# Altium schematic sheet Sheet1.SchDoc
size A3; SheetNumber: 1; SheetTotal: 1
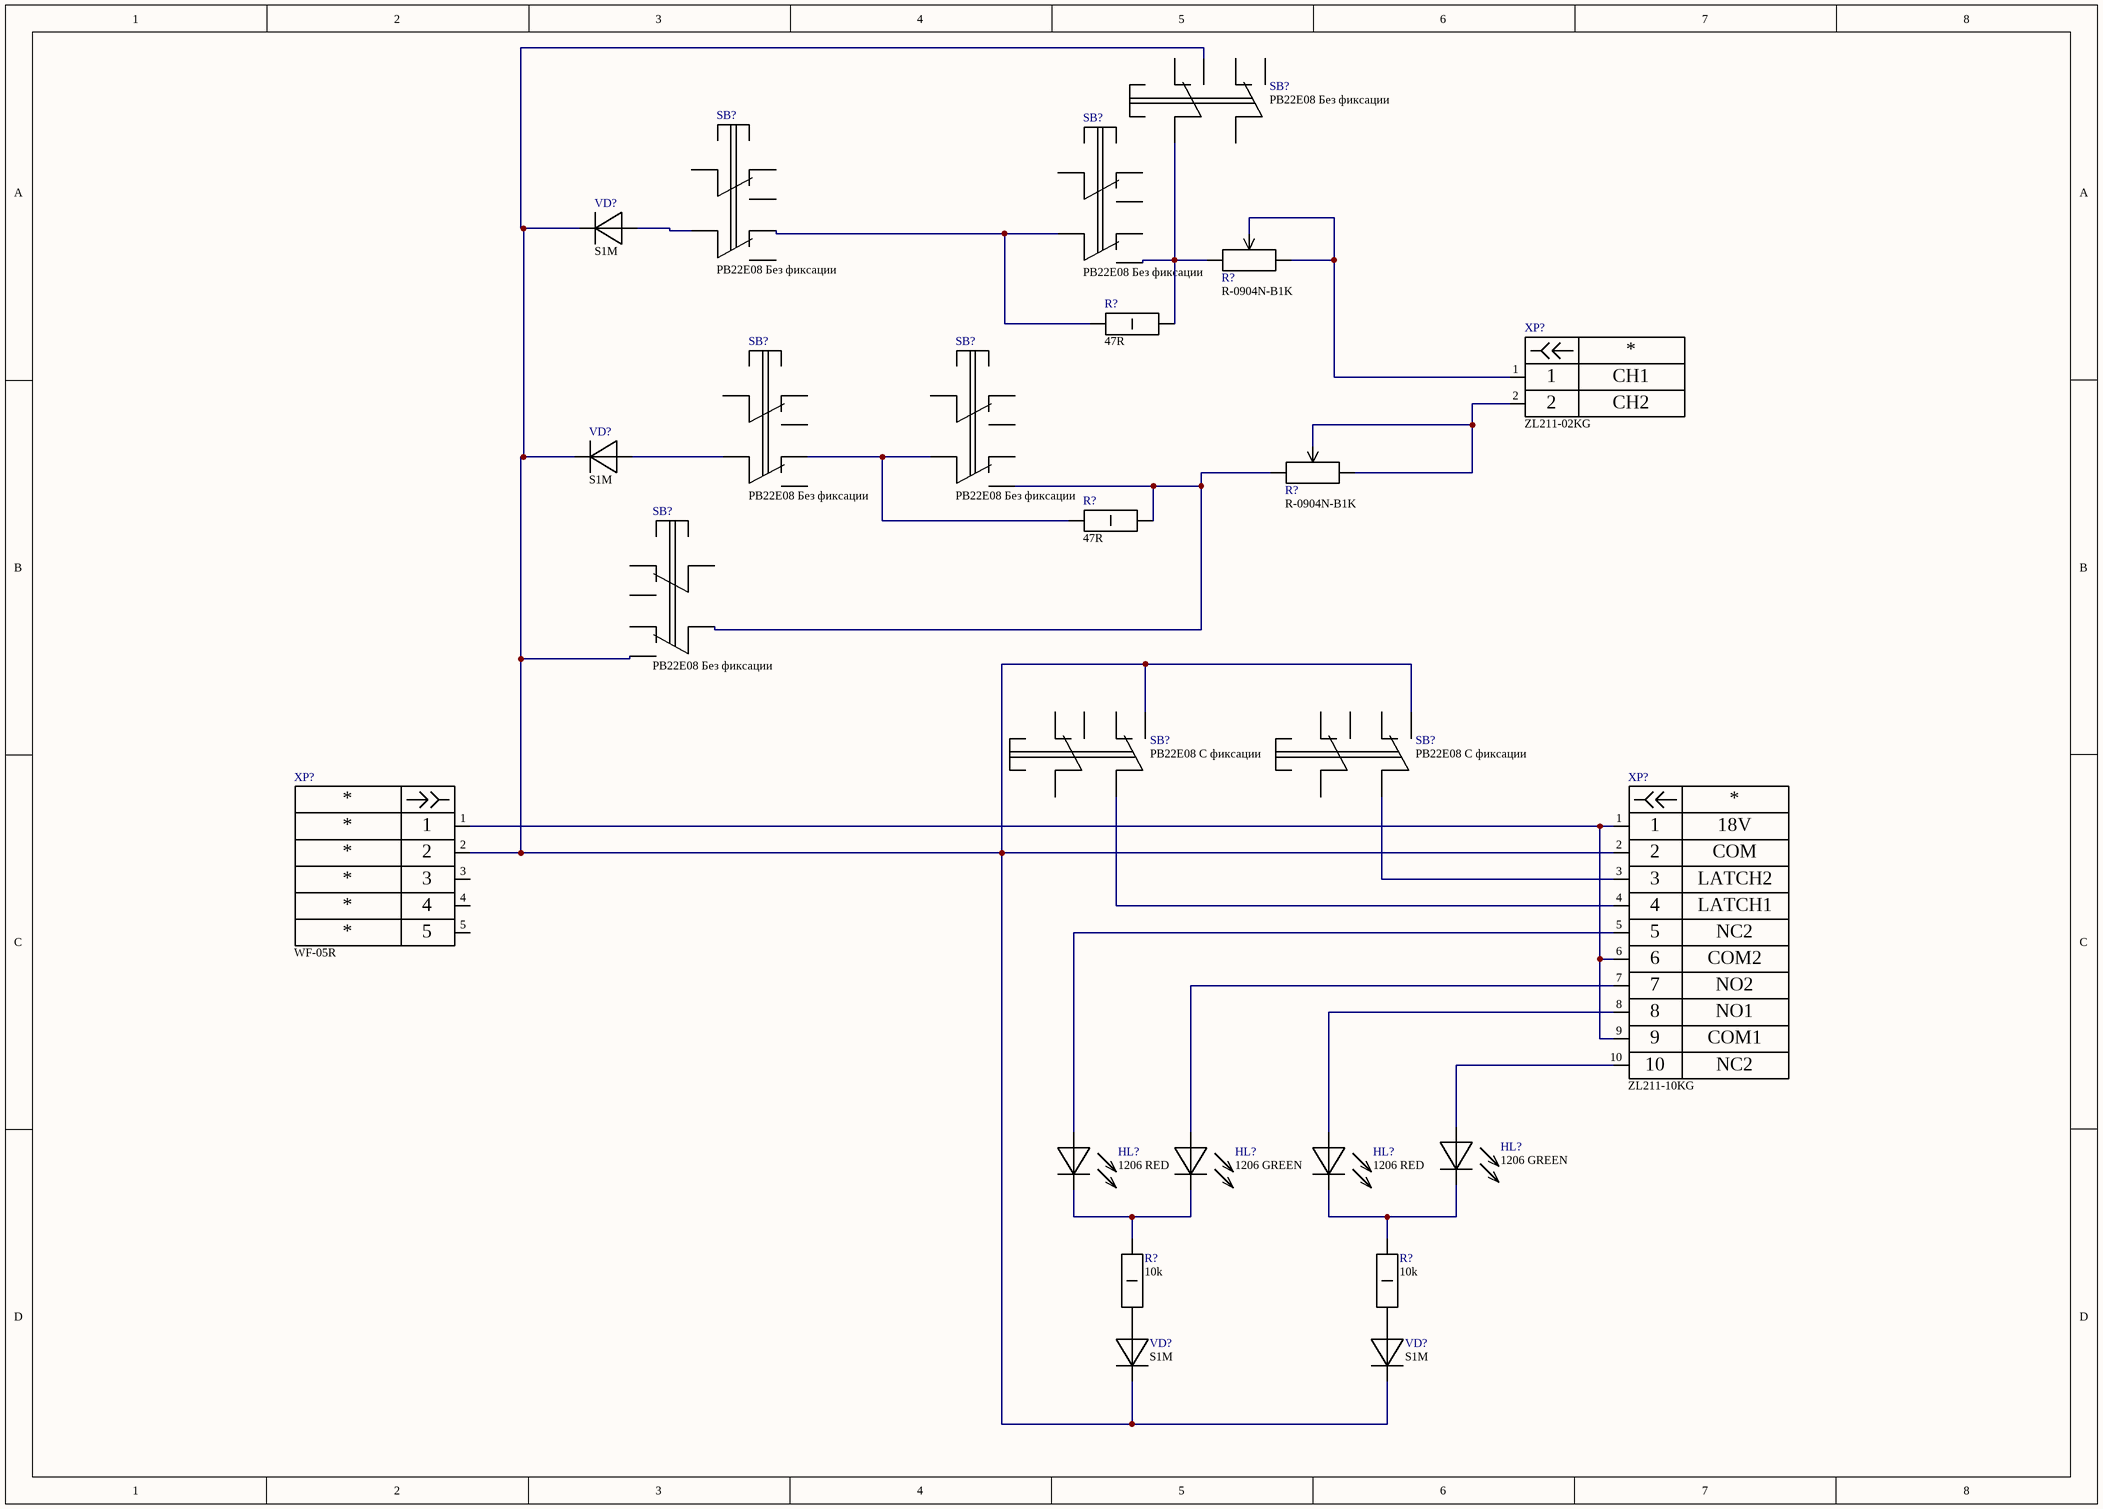
[diagram p0: Sheet1.SchDoc]

## Parts
(Parts that share a designator on the sheet are numbered #1, #2 ... from top to bottom, then left to right.)
HL?#1  1206 GREEN  [LED 0805]
HL?#2  1206 RED  [LED 0805]
HL?#3  1206 GREEN  [LED 0805]
HL?#4  1206 RED  [LED 0805]
R?#1  R-0904N-B1K  [R-0904N-B1K]
R?#2  47R  [Resistor 2512]
R?#3  R-0904N-B1K  [R-0904N-B1K]
R?#4  47R  [Resistor 2512]
R?#5  10k  [Resistor 2512]
R?#6  10k  [Resistor 2512]
SB?#1  PB22E08 Без фиксации  [PB22E08]
SB?#2  PB22E08 Без фиксации  [PB22E08]
SB?#3  PB22E08 Без фиксации  [PB22E08]
SB?#4  PB22E08 Без фиксации  [PB22E08]
SB?#5  PB22E08 Без фиксации  [PB22E08]
SB?#6  PB22E08 Без фиксации  [PB22E08]
SB?#7  PB22E08 C фиксации
SB?#8  PB22E08 C фиксации
VD?#1  S1M  [DO-214AC SMA]
VD?#2  S1M  [DO-214AC SMA]
VD?#3  S1M  [DO-214AC SMA]
VD?#4  S1M  [DO-214AC SMA]
XP?#1  ZL211-02KG  Name1: CH1  Name2: CH2  [Pins 1x2]
XP?#2  WF-05R  [WF-05]
XP?#3  ZL211-10KG  Name1: 18V  Name2: COM  Name3: LATCH2  Name4: LATCH1  Name5: NC2  Name6: COM2  Name7: NO2  Name8: NO1  Name9: COM1  [Pins 1x10]

## Nets
NetHL?#1_1: HL?#1.1(A) XP?#3.10
NetHL?#1_2: HL?#1.2(K) HL?#4.2(K) R?#6.2
NetHL?#2_1: HL?#2.1(A) XP?#3.5
NetHL?#2_2: HL?#2.2(K) HL?#3.2(K) R?#5.2
NetHL?#3_1: HL?#3.1(A) XP?#3.7
NetHL?#4_1: HL?#4.1(A) XP?#3.8
NetR?#1_1: R?#1.1 R?#2.2 SB?#1.3 SB?#3.5
NetR?#1_2: R?#1.2 R?#1.3 XP?#1.1
NetR?#2_1: R?#2.1 SB?#2.6 SB?#3.4
NetR?#3_1: R?#3.1 R?#4.2 SB?#5.5 SB?#6.4
NetR?#3_2: R?#3.2 R?#3.3 XP?#1.2
NetR?#4_1: R?#4.1 SB?#4.6 SB?#5.4
NetR?#5_1: R?#5.1 VD?#3.1(A)
NetR?#6_1: R?#6.1 VD?#4.1(A)
NetSB?#1_2: SB?#1.2 SB?#6.5 SB?#7.5 SB?#8.5 VD?#1.2(K) VD?#2.2(K) VD?#3.2(K) VD?#4.2(K) XP?#2.2 XP?#3.2
NetSB?#2_4: SB?#2.4 VD?#1.1(A)
NetSB?#4_4: SB?#4.4 VD?#2.1(A)
NetSB?#7_4: SB?#7.4 XP?#3.4
NetSB?#8_4: SB?#8.4 XP?#3.3
NetXP?#2_1: XP?#2.1 XP?#3.1 XP?#3.6 XP?#3.9

Not connected (* = marked no-connect by the designer): SB?#1 1 4 5 6; SB?#2 1 2 3 5; SB?#3 1 2 3 6; SB?#4 1 2 3 5; SB?#5 1 2 3 6; SB?#6 1 2 3 6; SB?#7 1 2 3 6; SB?#8 1 2 3 6; XP?#2 3 4 5

## Library data of the parts
HL?#1-HL?#4 = LED: Comments: *
R?#2 R?#4-R?#6 = Resistor 1W: Comments: *
SB?#1-SB?#6 = PB22E08(Non)
SB?#7 SB?#8 = PB22E08
XP?#1 = Pins 1x2: Comments: *; Name: *
XP?#2 = Pins 1x5: Comments: *; Name1: *; Name: *; Name2: *; Name3: *; Name4: *; Name5: *
XP?#3 = Pins 1x10: Comments: *; Name: *; Name10: NC2
VD?#1-VD?#4 = S1M: Comments: *